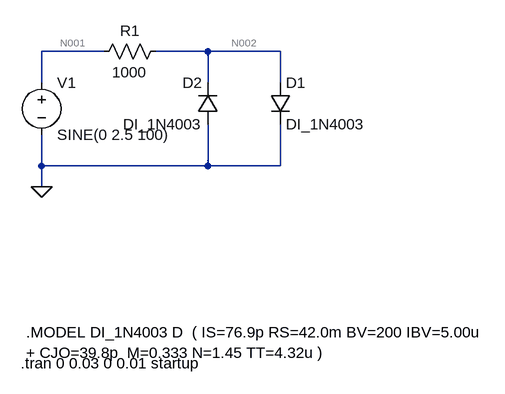
[diagram p0: schematic B1a.asc]
B1a.asc, the LTspice schematic file:
Version 4.1
SHEET 1 1132 680
WIRE 128 64 32 64
WIRE 288 64 208 64
WIRE 400 64 288 64
WIRE 32 112 32 64
WIRE 288 112 288 64
WIRE 400 112 400 64
WIRE 32 240 32 192
WIRE 288 240 288 176
WIRE 288 240 32 240
WIRE 400 240 400 176
WIRE 400 240 288 240
WIRE 32 272 32 240
FLAG 32 272 0
SYMBOL voltage 32 96 R0
WINDOW 123 0 0 Left 0
WINDOW 39 0 0 Left 0
SYMATTR InstName V1
SYMATTR Value SINE(0 2.5 100)
SYMBOL res 224 48 R90
WINDOW 0 0 56 VBottom 2
WINDOW 3 32 56 VTop 2
SYMATTR InstName R1
SYMATTR Value 1000
SYMBOL diode 384 112 R0
SYMATTR InstName D1
SYMATTR Value DI_1N4003
SYMBOL diode 304 176 R180
WINDOW 0 24 64 Left 2
WINDOW 3 24 0 Left 2
SYMATTR InstName D2
SYMATTR Value DI_1N4003
TEXT 8 496 Left 2 !.MODEL DI_1N4003 D  ( IS=76.9p RS=42.0m BV=200 IBV=5.00u\n+ CJO=39.8p  M=0.333 N=1.45 TT=4.32u )
TEXT 0 544 Left 2 !.tran 0 0.03 0 0.01 startup

The netlist it stands for:
* B1a.asc
V1 N001 0 SINE(0 2.5 100)
R1 N002 N001 1000
D1 N002 0 DI_1N4003
D2 0 N002 DI_1N4003
.model D D
.lib standard.dio
.MODEL DI_1N4003 D  ( IS=76.9p RS=42.0m BV=200 IBV=5.00u
+ CJO=39.8p  M=0.333 N=1.45 TT=4.32u )
.tran 0 0.03 0 0.01 startup
.backanno
.end

* Results of the author's LTspice run, read from the files saved beside the schematic
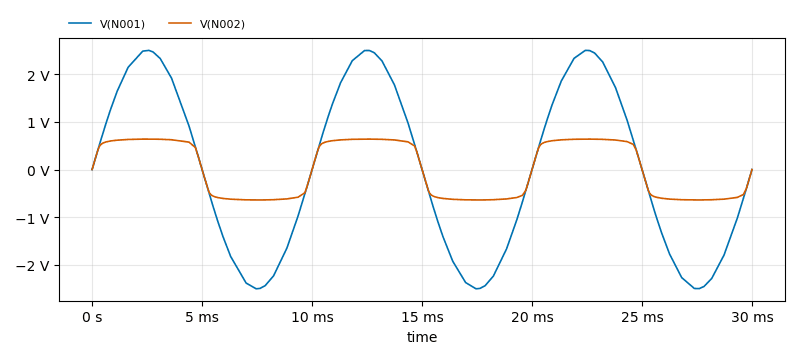
[diagram p1: Transient Analysis of B1a.asc, plotted from the saved traces]
* Transient Analysis, 1 run:
*   V(N001): min -2.499 V, max 2.497 V, average -338.3 µV, rms 1.763 V, last 0 V
*   V(N002): min -637.7 mV, max 637.8 mV, average -216.5 µV, rms 579.4 mV, last -517.2 µV